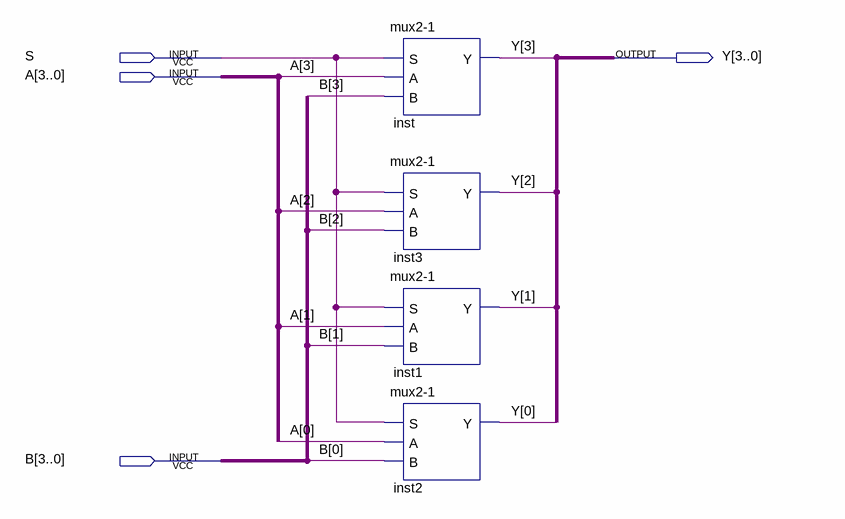
[diagram p0: schematic sheet]
// Quartus schematic selector.bdf as structural Verilog: 4 symbols, 4 pins
module selector (
  input  S,
  input  [3:0] A,
  input  [3:0] B,
  output [3:0] Y
);

  \mux2-1  inst (.S(S), .A(A[3]), .B(B[3]), .Y(Y[3]));
  \mux2-1  inst3 (.S(S), .A(A[2]), .B(B[2]), .Y(Y[2]));
  \mux2-1  inst1 (.S(S), .A(A[1]), .B(B[1]), .Y(Y[1]));
  \mux2-1  inst2 (.S(S), .A(A[0]), .B(B[0]), .Y(Y[0]));
endmodule
